# Altium schematic sheet 05_LEDs.SchDoc: ECE315 LEDs
size A; Date: 01/08/2018; ApprovedBy: JSK; CheckedBy: JSK; Author: JSK; CompanyName: University of Wisconsin; DrawnBy: JSK; Engineer: JSK; Organization: ECE 315; Address1: College of Engineering; Address2: 1415 Engineering Drive; Address3: Madison, WI 53706; Address4: ECE 315 Spring 2018; Revision: A; SheetNumber: 5; SheetTotal: 6; AssemblyNumber: ECE315-S18; ApprovedDate: ECE315-S18
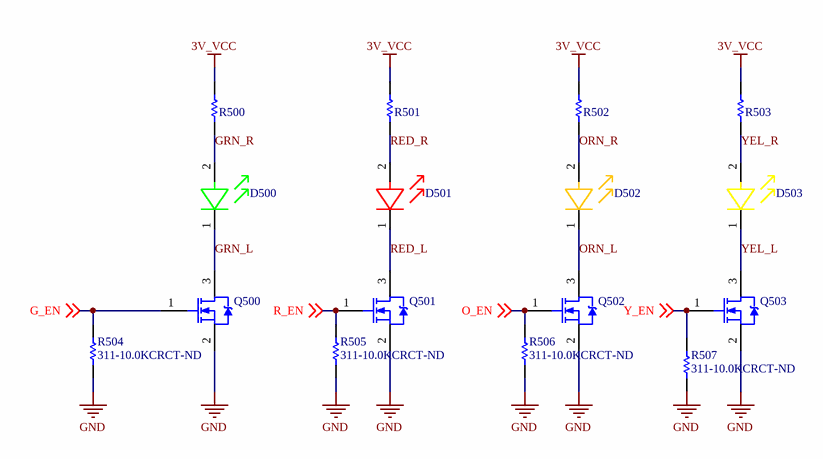
[diagram p0: 05_LEDs.SchDoc]

## Parts
D500  LED_GREEN_0805.1  [LED_GRN_0805]  (value not drawn)
D501  LED_RED_0805.1  [LED_RED_0805]  (value not drawn)
D502  LED_ORANGE.0805.1  [LED_ORG_0805]  (value not drawn)
D503  LED_YELLOW_0805.1  [LED_YEL_0805]  (value not drawn)
Q500  IC_NMOS_DMN2020LSN  [SOT23]  (value not drawn)
Q501  IC_NMOS_DMN2020LSN  [SOT23]  (value not drawn)
Q502  IC_NMOS_DMN2020LSN  [SOT23]  (value not drawn)
Q503  IC_NMOS_DMN2020LSN  [SOT23]  (value not drawn)
R500  330  [RES_0805]  (value not drawn)
R501  330  [RES_0805]  (value not drawn)
R502  330  [RES_0805]  (value not drawn)
R503  330  [RES_0805]  (value not drawn)
R504  Supplier Part Number 1: 311-10.0KCRCT-ND  [RES_0805]  (hidden comment: 10K)
R505  Supplier Part Number 1: 311-10.0KCRCT-ND  [RES_0805]  (hidden comment: 10K)
R506  Supplier Part Number 1: 311-10.0KCRCT-ND  [RES_0805]  (hidden comment: 10K)
R507  Supplier Part Number 1: 311-10.0KCRCT-ND  [RES_0805]  (hidden comment: 10K)

## Nets
3V_VCC: R500.2 R501.2 R502.2 R503.2
GND: Q500.2 Q501.2 Q502.2 Q503.2 R504.1 R505.1 R506.1 R507.1
G_EN: Q500.1 R504.2 ; off-sheet G_EN
GRN_L: D500.1(Cathode) Q500.3
GRN_R: D500.2(Anode) R500.1
O_EN: Q502.1 R506.2 ; off-sheet O_EN
ORN_L: D502.1(Cathode) Q502.3
ORN_R: D502.2(Anode) R502.1
R_EN: Q501.1 R505.2 ; off-sheet R_EN
RED_L: D501.1(Cathode) Q501.3
RED_R: D501.2(Anode) R501.1
Y_EN: Q503.1 R507.2 ; off-sheet Y_EN
YEL_L: D503.1(Cathode) Q503.3
YEL_R: D503.2(Anode) R503.1

## Notes on the sheet
- Title:
- Size:
- A
- Machine:
- P.C. Board No:
- Assembly No:
- Rev:
- Sheet:
- of
- College of Engineering
- 1415 Engineering Drive
- Madison, WI 53706

## Library data of the parts
D500 = LED_GREEN_0805.1: LED GREEN CLEAR THIN 0805 SMD; Manufacturer: Vishay / Lite-On; Manufacturer Part Number: LTST-C171KGKT; Chip Material: AlGaInP; DELETED: Compliant; Emitting Color: Yellow Green; Forward Voltage: 2.4 V; Forward Current: 30 mA; Dominant Wave Length: 571 nm; Lum Intensity: 35mcd; High Brightness: Yes; Number of  Elements: 1; Main Category: Chip LED; Power Dissipation: 75 W; Peak Wavelength: 574 nm; Shape Type: Rectangular; Type: Uni-Color; Reverse Voltage: 5 V; Viewing Angle: 130 deg; Test Current (It): 20 mA; Rad Hardened: No; Product Depth (mm): 1.25 mm; Product Height (mm): 0.8 mm; Product Length (mm): 2 mm; Supplier 1: Digi-Key; Stock 1: 322411; Pricing 1: 1=0.31, 10=0.225, 25=0.1656, 100=0.1183, 250=0.0804, 500=0.071, 1000=0.0556 (USD); Mounting: Surface Mount; Operating Temp Range: -55C to 85C; Lens Dimensions: 1.4x1.25x0.5 mm; Luminous Intensity: 35mcd; Package Type: Chip Led; Packaging: Tape and Reel; Pin Count: 2; Operating Temperature Classification: Industrial; ComponentLink1URL: https://datasheet.ciiva.com/15118/getdatasheetpartid-214542-15118099.pdf; ComponentLink1Description: https://datasheet.ciiva.com/15118/getdatasheetpartid-214542-15118099.pdf; ComponentLink2URL: https://datasheet.ciiva.com/16200/lite-on20ltst-c171kgkt-16200100.pdf; ComponentLink2Description: https://datasheet.ciiva.com/16200/lite-on20ltst-c171kgkt-16200100.pdf; ComponentLink3URL: https://datasheet.ciiva.com/2110/s-110-ltst-c171kgkt-2110072.pdf; ComponentLink3Description: https://datasheet.ciiva.com/2110/s-110-ltst-c171kgkt-2110072.pdf; ComponentLink4URL: https://datasheet.ciiva.com/2110/s-110-ltst-c171kgkt-2110073.pdf; ComponentLink4Description: https://datasheet.ciiva.com/2110/s-110-ltst-c171kgkt-2110073.pdf; ComponentLink5URL: https://datasheet.ciiva.com/11774/0900766b80dc0298-11774377.pdf; ComponentLink5Description: https://datasheet.ciiva.com/11774/0900766b80dc0298-11774377.pdf; ComponentLink6URL: https://datasheet.ciiva.com/2110/s-110-ltst-c171kgkt-2110074.pdf; ComponentLink6Description: https://datasheet.ciiva.com/2110/s-110-ltst-c171kgkt-2110074.pdf; ComponentLink7URL: https://datasheet.ciiva.com/12400/lite-on-ltst-c171kgkt-187692-12400799.pdf; ComponentLink7Description: https://datasheet.ciiva.com/12400/lite-on-ltst-c171kgkt-187692-12400799.pdf; Supplier Part Number 1: 160-1426-1-ND
D501 = LED_RED_0805.1: LED SUPER RED CLR THIN 0805 SMD; Manufacturer: Vishay / Lite-On; Manufacturer Part Number: LTST-C171KRKT; Chip Material: AlGaInP; DELETED: Compliant; Dominant Wave Length: 631 nm; Forward Current: 30 mA; Forward Voltage: 2.4 V; High Brightness: Yes; Lum Intensity: 54mcd; Main Category: Chip LED; Number of  Elements: 1; Peak Wavelength: 639 nm; Power Dissipation: 75 W; Product Depth (mm): 1.25 mm; Product Height (mm): 0.8 mm; Product Length (mm): 2 mm; Rad Hardened: No; Reverse Voltage: 5 V; Shape Type: Rectangular; Test Current (It): 20 mA; Type: Uni-Color; Viewing Angle: 130 deg; Supplier 1: Digikey; Stock 1: 97347; Pricing 1: 1=0.31, 10=0.225, 25=0.1656, 100=0.1183, 250=0.0804, 500=0.071, 1000=0.0556 (USD); Emitting Color: Red; Lens Dimensions: 1.4x1.25x0.5 mm; Luminous Intensity: 54mcd; Mounting: Surface Mount; Operating Temp Range: -55C to 85C; Operating Temperature Classification: Industrial; Package Type: Chip Led; Packaging: Tape and Reel; Pin Count: 2; ComponentLink1URL: https://datasheet.ciiva.com/2110/s-110-ltst-c171krkt-2110066.pdf; ComponentLink1Description: https://datasheet.ciiva.com/2110/s-110-ltst-c171krkt-2110066.pdf; ComponentLink2URL: https://datasheet.ciiva.com/2110/s-110-ltst-c171krkt-2110067.pdf; ComponentLink2Description: https://datasheet.ciiva.com/2110/s-110-ltst-c171krkt-2110067.pdf; ComponentLink3URL: https://datasheet.ciiva.com/2110/s-110-ltst-c171krkt-2110068.pdf; ComponentLink3Description: https://datasheet.ciiva.com/2110/s-110-ltst-c171krkt-2110068.pdf; ComponentLink4URL: https://datasheet.ciiva.com/12403/lite-on-ltst-c171krkt-187201-12403781.pdf; ComponentLink4Description: https://datasheet.ciiva.com/12403/lite-on-ltst-c171krkt-187201-12403781.pdf; ComponentLink5URL: https://datasheet.ciiva.com/11775/0900766b80dc0299-11775643.pdf; ComponentLink5Description: https://datasheet.ciiva.com/11775/0900766b80dc0299-11775643.pdf; ComponentLink6URL: https://datasheet.ciiva.com/16444/lite-on20ltst-c171krkt-16444779.pdf; ComponentLink6Description: https://datasheet.ciiva.com/16444/lite-on20ltst-c171krkt-16444779.pdf; Supplier Part Number 1: 160-1427-1-ND
D502 = LED_ORANGE.0805.1: LED ORANGE DIFFUSED 0805 SMD; Manufacturer: Rohm; Manufacturer Part Number: SML-210DTT86; Intensity: 6.3 mcd; Lens Type: Clear; Forward (Drive) Current: 25 mA; Forward Voltage: 2 V; Viewing Angle: 130 °; Supplier 1: Digikey; Stock 1: 28453; Pricing 1: 1=0.39, 10=0.277, 25=0.2404, 100=0.1848, 250=0.1502, 500=0.1109, 1000=0.0924 (USD); Color: Orange; Dimension: 2 x 1.25 x 0.8 mm; ComponentLink1URL: https://datasheet.ciiva.com/2110/sml-21-2110727.pdf; ComponentLink1Description: https://datasheet.ciiva.com/2110/sml-21-2110727.pdf; ComponentLink2URL: https://datasheet.ciiva.com/2110/sml-21-2110728.pdf; ComponentLink2Description: https://datasheet.ciiva.com/2110/sml-21-2110728.pdf; ComponentLink3URL: https://datasheet.ciiva.com/2110/sml-21-2110729.pdf; ComponentLink3Description: https://datasheet.ciiva.com/2110/sml-21-2110729.pdf; ComponentLink4URL: https://datasheet.ciiva.com/11773/0900766b80df3a40-11773931.pdf; ComponentLink4Description: https://datasheet.ciiva.com/11773/0900766b80df3a40-11773931.pdf; ComponentLink5URL: https://datasheet.ciiva.com/16488/sml-210ltt86-16488028.pdf; ComponentLink5Description: https://datasheet.ciiva.com/16488/sml-210ltt86-16488028.pdf; Supplier Part Number 1: 511-1284-1-ND
D503 = LED_YELLOW_0805.1: LED YELLOW CLEAR THIN 0805 SMD; Manufacturer: Vishay / Lite-On; Manufacturer Part Number: LTST-C171KSKT; Chip Material: AlGaInP; DELETED: Compliant; Emitting Color: Amber; Forward Voltage: 2.4 V; Forward Current: 30 mA; Dominant Wave Length: 587 nm; Lum Intensity: 50mcd; High Brightness: Yes; Number of  Elements: 1; Main Category: Chip LED; Power Dissipation: 75 W; Peak Wavelength: 588 nm; Shape Type: Rectangular; Type: Uni-Color; Reverse Voltage: 5 V; Viewing Angle: 130 deg; Test Current (It): 20 mA; Rad Hardened: No; Product Depth (mm): 1.25 mm; Product Height (mm): 0.8 mm; Product Length (mm): 2 mm; Supplier 1: Digikey; Stock 1: 18113; Pricing 1: 1=0.33, 10=0.239, 25=0.1764, 100=0.126, 250=0.0856, 500=0.0756, 1000=0.0592 (USD); Mounting: Surface Mount; Operating Temp Range: -55C to 85C; Lens Dimensions: 1.4x1.25x0.5 mm; Luminous Intensity: 50mcd; Package Type: Chip Led; Packaging: Tape and Reel; Pin Count: 2; Operating Temperature Classification: Industrial; ComponentLink1URL: https://datasheet.ciiva.com/15118/getdatasheetpartid-233685-15118145.pdf; ComponentLink1Description: https://datasheet.ciiva.com/15118/getdatasheetpartid-233685-15118145.pdf; ComponentLink2URL: https://datasheet.ciiva.com/2110/s-110-ltst-c171kskt-2110147.pdf; ComponentLink2Description: https://datasheet.ciiva.com/2110/s-110-ltst-c171kskt-2110147.pdf; ComponentLink3URL: https://datasheet.ciiva.com/2110/s-110-ltst-c171kskt-2110148.pdf; ComponentLink3Description: https://datasheet.ciiva.com/2110/s-110-ltst-c171kskt-2110148.pdf; ComponentLink4URL: https://datasheet.ciiva.com/19466/2075639-19466196.pdf; ComponentLink4Description: https://datasheet.ciiva.com/19466/2075639-19466196.pdf; ComponentLink5URL: https://datasheet.ciiva.com/2110/s-110-ltst-c171kskt-2110149.pdf; ComponentLink5Description: https://datasheet.ciiva.com/2110/s-110-ltst-c171kskt-2110149.pdf; ComponentLink6URL: https://datasheet.ciiva.com/16200/lite-on20ltst-c171kskt-16200102.pdf; ComponentLink6Description: https://datasheet.ciiva.com/16200/lite-on20ltst-c171kskt-16200102.pdf; ComponentLink7URL: https://datasheet.ciiva.com/12403/lite-on-ltst-c171kskt-190118-12403721.pdf; ComponentLink7Description: https://datasheet.ciiva.com/12403/lite-on-ltst-c171kskt-190118-12403721.pdf; ComponentLink8URL: https://datasheet.ciiva.com/11774/0900766b80dc029a-11774587.pdf; ComponentLink8Description: https://datasheet.ciiva.com/11774/0900766b80dc029a-11774587.pdf; Supplier Part Number 1: 160-1428-1-ND
Q500-Q503 = IC_NMOS_DMN2020LSN: Manufacturer: Diodes; Manufacturer Part Number: DMN2020LSN-7; Rise Time: 12.49ns; Continuous Drain Current (ID): 6.9A; Gate to Source Voltage (Vgs): 12V; Turn-Off Delay Time: 35.89ns; Turn-On Delay Time: 11.67ns; Fall Time: 12.33ns; Input Capacitance: 1.149nF; Number of Elements: 1; Max Power Dissipation: 610mW; Rds On Max: 20mR; Drain to Source Resistance: 13mR; Drain to Source Voltage (Vdss): 20V; Threshold Voltage: 1V; Element Configuration: Single; Supplier 1: Digikey; Stock 1: 13099; Pricing 1: 1=0.52, 10=0.418, 100=0.2843, 500=0.2132, 1000=0.1599 (USD); Mount: Surface Mount; Case/Package: SC; Number of Pins: 3; Weight: 0.000282oz; Min Operating Temperature: -55°C; Max Operating Temperature: 150°C; Packaging: Tape and Reel; Package Quantity: 3000; Power Dissipation: 610mW; Number of Channels: 1; Length: 3.1mm; Height: 1.3mm; Width: 1.7mm; REACH SVHC: No SVHC; Lead Free: Lead Free; ComponentLink1URL: https://datasheet.ciiva.com/934/ds31946-934870.pdf; ComponentLink1Description: https://datasheet.ciiva.com/934/ds31946-934870.pdf; ComponentLink2URL: https://datasheet.ciiva.com/25625/0900766b8104e58b-25625153.pdf; ComponentLink2Description: https://datasheet.ciiva.com/25625/0900766b8104e58b-25625153.pdf; ComponentLink3URL: https://datasheet.ciiva.com/4444/ds31946-65244-4444482.pdf; ComponentLink3Description: https://datasheet.ciiva.com/4444/ds31946-65244-4444482.pdf; ComponentLink4URL: https://datasheet.ciiva.com/934/ds31946-934871.pdf; ComponentLink4Description: https://datasheet.ciiva.com/934/ds31946-934871.pdf; ComponentLink5URL: https://datasheet.ciiva.com/934/ds31946-934872.pdf; ComponentLink5Description: https://datasheet.ciiva.com/934/ds31946-934872.pdf; Supplier Part Number 1: DMN2020LSN-7DICT-ND
R500-R503 = RES_0805_R_330.00: RES SMD 330 OHM 1% 1/8W 0805; Manufacturer: Yageo; Manufacturer Part Number: RC0805FR-07330RL; Power (Watts): 0.125W, 1/8W; Temperature Coefficient: ±100ppm/°C; Supplier 1: Digi-Key; RoHS: RoHS Compliant; Category: Resistors; Stock 1: 1392719; Pricing 1: 1=0.1, 10=0.022, 100=0.0088, 1000=0.00396, 2500=0.00344 (USD); Packaging: Cut Tape (CT); Part Status: Active; Tolerance: ±1%; Composition: Thick Film; Features: Moisture Resistant; Operating Temperature: -55°C ~ 155°C; Package / Case: 0805 (2012 Metric); Supplier Device Package: 0805; Size / Dimension: 0.079" L x 0.049" W (2.00mm x 1.25mm); Height - Seated (Max): 0.024" (0.60mm); Failure Rate: -; ComponentLink1URL: http://www.yageo.com/documents/recent/PYu-RC_Group_51_RoHS_L_8.pdf; ComponentLink1Description: http://www.yageo.com/documents/recent/PYu-RC_Group_51_RoHS_L_8.pdf; Supplier Part Number 1: 311-330CRCT-ND
R504-R507 = RES_0805_K_010.00: RES SMD 10K OHM 1% 1/8W 0805; Manufacturer: Yageo; Manufacturer Part Number: RC0805FR-0710KL; Power (Watts): 0.125W, 1/8W; Temperature Coefficient: ±100ppm/°C; Supplier 1: Digi-Key; RoHS: RoHS Compliant; Category: Resistors; Stock 1: 15506828; Pricing 1: 1=0.1, 10=0.022, 100=0.0088, 1000=0.00396, 2500=0.00344 (USD); Packaging: Cut Tape (CT); Part Status: Active; Tolerance: ±1%; Composition: Thick Film; Features: Moisture Resistant; Operating Temperature: -55°C ~ 155°C; Package / Case: 0805 (2012 Metric); Supplier Device Package: 0805; Size / Dimension: 0.079" L x 0.049" W (2.00mm x 1.25mm); Height - Seated (Max): 0.024" (0.60mm); Failure Rate: -; ComponentLink1URL: http://www.yageo.com/documents/recent/PYu-RC_Group_51_RoHS_L_8.pdf; ComponentLink1Description: http://www.yageo.com/documents/recent/PYu-RC_Group_51_RoHS_L_8.pdf